# Altium schematic sheet Main.SchDoc
size A3
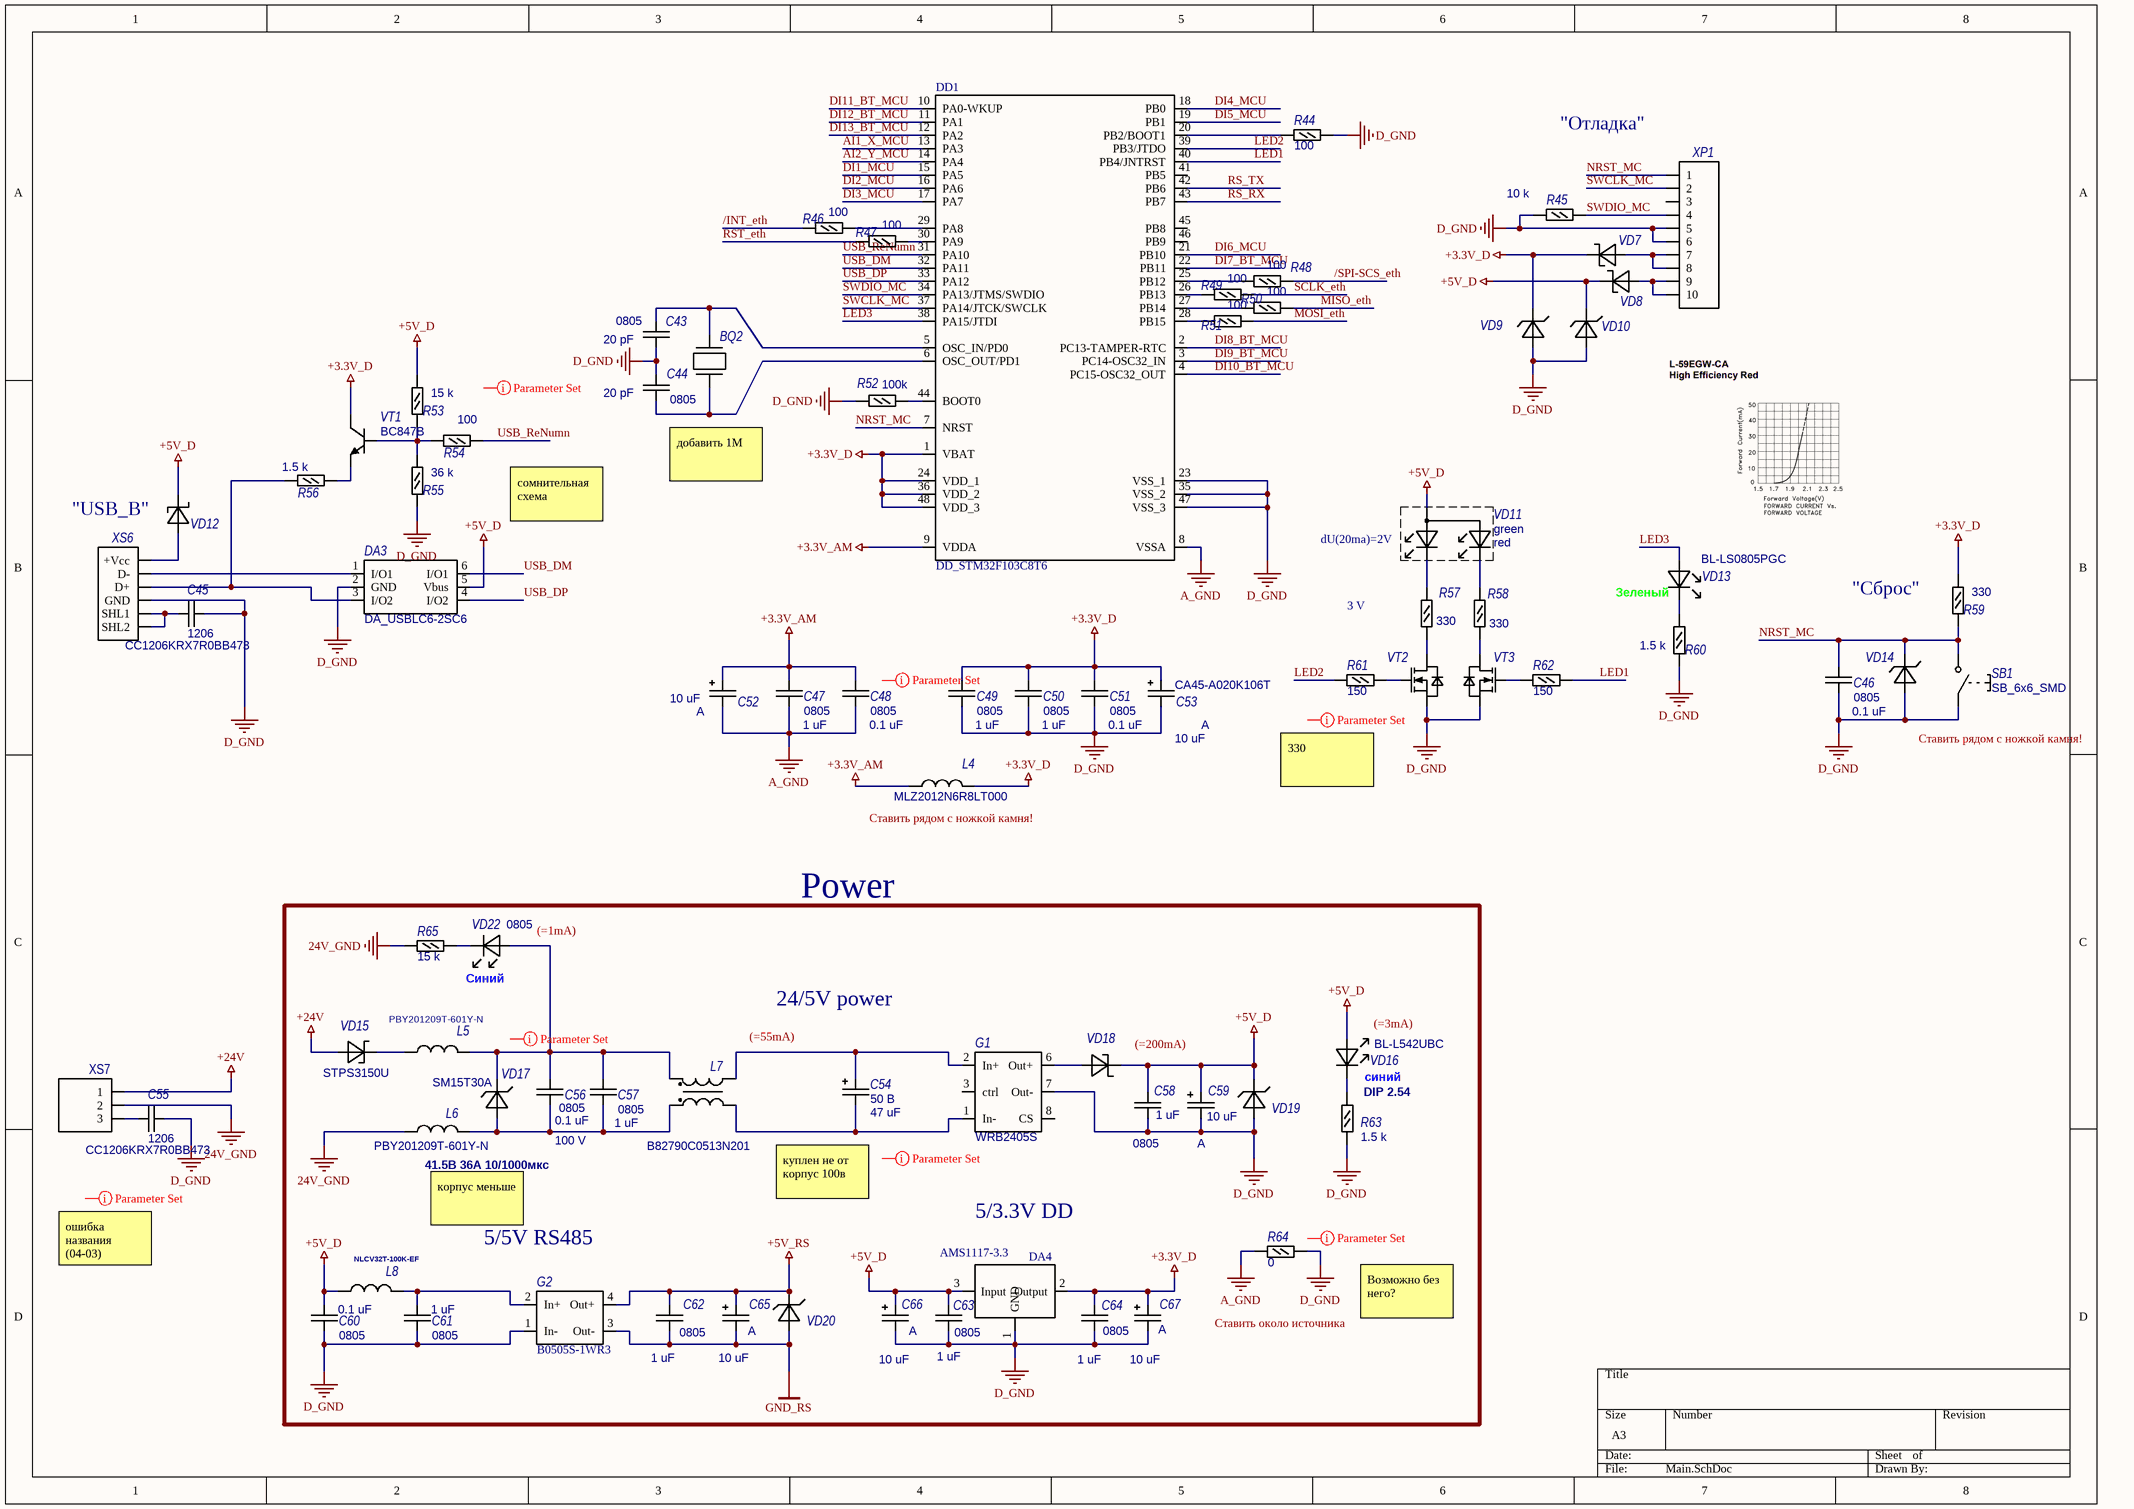
[diagram p0: Main.SchDoc]

## Parts
BQ2  (no value)  [Xtal_HC49S]
C43  0805  Номинал: 20 pF  [CAP_0805_(2x1.25x1.3)]
C44  0805  Номинал: 20 pF  [CAP_0805_(2x1.25x1.3)]
C45  1206  Наименование: CC1206KRX7R0BB473  [CAP_1206_(3.2x1.6x1.5)]
C46  0805  Номинал: 0.1 uF  [CAP_0805_(2x1.25x1.3)]
C47  0805  Номинал: 1 uF  [CAP_0805_(2x1.25x1.3)]
C48  0805  Номинал: 0.1 uF  [CAP_0805_(2x1.25x1.3)]
C49  0805  Номинал: 1 uF  [CAP_0805_(2x1.25x1.3)]
C50  0805  Номинал: 1 uF  [CAP_0805_(2x1.25x1.3)]
C51  0805  Номинал: 0.1 uF  [CAP_0805_(2x1.25x1.3)]
C52  Корпус: A  Номинал: 10 uF  [CAP_TAN_A]  (hidden comment: TAN_A)
C53  Корпус: A  Наименование: CA45-A020K106T  Номинал: 10 uF  [CAP_TAN_A]  (hidden comment: TAN_A)
C54  Напряжение: 50 В  Номинал: 47 uF  [CAP_EL_K50-35_(8x11.5)]  (hidden comment: K50-35)
C55  1206  Наименование: CC1206KRX7R0BB473  [CAP_1206_(3.2x1.6x1.5)]
C56  0805  Напряжение: 100 V  Номинал: 0.1 uF  [CAP_0805_(2x1.25x1.3)]
C57  0805  Номинал: 1 uF  [CAP_0805_(2x1.25x1.3)]
C58  0805  Номинал: 1 uF  [CAP_0805_(2x1.25x1.3)]
C59  Корпус: A  Номинал: 10 uF  [CAP_TAN_A]  (hidden comment: TAN_A)
C60  0805  Номинал: 0.1 uF  [CAP_0805_(2x1.25x1.3)]
C61  0805  Номинал: 1 uF  [CAP_0805_(2x1.25x1.3)]
C62  0805  Номинал: 1 uF  [CAP_0805_(2x1.25x1.3)]
C63  0805  Номинал: 1 uF  [CAP_0805_(2x1.25x1.3)]
C64  0805  Номинал: 1 uF  [CAP_0805_(2x1.25x1.3)]
C65  Корпус: A  Номинал: 10 uF  [CAP_TAN_A]  (hidden comment: TAN_A)
C66  Корпус: A  Номинал: 10 uF  [CAP_TAN_A]  (hidden comment: TAN_A)
C67  Корпус: A  Номинал: 10 uF  [CAP_TAN_A]  (hidden comment: TAN_A)
DA3  DA_USBLC6-2SC6  [SOT-23-6L]
DA4  AMS1117-3.3  [SOT-223_Dupl]
DD1  DD_STM32F103C8T6  [LQFP_48]
G1  WRB2405S  [WRB2405S(SIP-8) - duplicate]
G2  Наименование: B0505S-1WR3  [AM1S-Z]  (hidden comment: AM1S-Z)
L4  Наименование: MLZ2012N6R8LT000  [L_0805]  (hidden comment: PBY201209T-601Y-N)
L5  PBY201209T-601Y-N  [L_0805]
L6  PBY201209T-601Y-N  [L_0805]
L7  Наименование: B82790C0513N201  [B82790]  (hidden comment: B82790)
L8  Наименование: NLCV32T-100K-EF  [L_SRN3015]  (hidden comment: SRN3015)
R44  Номинал: 100  [RES_0805_(2x1.2x0.45)_0.125Вт]  (hidden comment: 0805)
R45  Номинал: 10 k  [RES_0805_(2x1.2x0.45)_0.125Вт]  (hidden comment: 0805)
R46  Номинал: 100  [RES_0805_(2x1.2x0.45)_0.125Вт]  (hidden comment: 0805)
R47  Номинал: 100  [RES_0805_(2x1.2x0.45)_0.125Вт]  (hidden comment: 0805)
R48  Номинал: 100  [RES_0805_(2x1.2x0.45)_0.125Вт]  (hidden comment: 0805)
R49  Номинал: 100  [RES_0805_(2x1.2x0.45)_0.125Вт]  (hidden comment: 0805)
R50  Номинал: 100  [RES_0805_(2x1.2x0.45)_0.125Вт]  (hidden comment: 0805)
R51  Номинал: 100  [RES_0805_(2x1.2x0.45)_0.125Вт]  (hidden comment: 0805)
R52  Номинал: 100k  [RES_0805_(2x1.2x0.45)_0.125Вт]  (hidden comment: 0805)
R53  Номинал: 15 k  [RES_0805_(2x1.2x0.45)_0.125Вт]  (hidden comment: 0805)
R54  Номинал: 100  [RES_0805_(2x1.2x0.45)_0.125Вт]  (hidden comment: 0805)
R55  Номинал: 36 k  [RES_0805_(2x1.2x0.45)_0.125Вт]  (hidden comment: 0805)
R56  Номинал: 1.5 k  [RES_0805_(2x1.2x0.45)_0.125Вт]  (hidden comment: 0805)
R57  Номинал: 330  [RES_0805_(2x1.2x0.45)_0.125Вт]  (hidden comment: 0805)
R58  Номинал: 330  [RES_0805_(2x1.2x0.45)_0.125Вт]  (hidden comment: 0805)
R59  Номинал: 330  [RES_0805_(2x1.2x0.45)_0.125Вт]  (hidden comment: 0805)
R60  Номинал: 1.5 k  [RES_0805_(2x1.2x0.45)_0.125Вт]  (hidden comment: 0805)
R61  Номинал: 150  [RES_0805_(2x1.2x0.45)_0.125Вт]  (hidden comment: 0805)
R62  Номинал: 150  [RES_0805_(2x1.2x0.45)_0.125Вт]  (hidden comment: 0805)
R63  Номинал: 1.5 k  [RES_0805_(2x1.2x0.45)_0.125Вт]  (hidden comment: 0805)
R64  Номинал: 0  [RES_0805_(2x1.2x0.45)_0.125Вт]  (hidden comment: 0805)
R65  Номинал: 15 k  [RES_0805_(2x1.2x0.45)_0.125Вт]  (hidden comment: 0805)
SB1  SB_6x6_SMD  [SB_6x6_SMD]
VD7  VD_SH_SMA  [VD_SMA_(Do-214AC)]  (value not drawn)
VD8  VD_SH_SMA  [VD_SMA_(Do-214AC)]  (value not drawn)
VD9  ESD  [VD_SOD523]  (value not drawn)
VD10  ESD  [VD_SOD523]  (value not drawn)
VD11  Тип: green  Примечания: red  [VD_LEDsx2]  (hidden comment: VD_Ledx2_dip)
VD12  VD_SH_SMA  [VD_SMA_(Do-214AC)]  (value not drawn)
VD13  Наименование: BL-LS0805PGC  Примечания: Зеленый  [led_0805]  (hidden comment: VD_Led_0805)
VD14  ESD  [VD_SOD523]  (value not drawn)
VD15  STPS3150U  [VD_SMB_(Do-214AA)]
VD16  Корпус: DIP 2.54  Наименование: BL-L542UBC  Примечания: синий  [VD_LED_dip]  (hidden comment: VD_Led)
VD17  SM15T30A  Номинал: 41.5В 36А 10/1000мкс  [VD_SMC_(Do-214AB)]
VD18  VD_SH_SMA  [VD_SMA_(Do-214AC)]  (value not drawn)
VD19  VD_SMA  [VD_SMA_(Do-214AC)]  (value not drawn)
VD20  VD_SMA  [VD_SMA_(Do-214AC)]  (value not drawn)
VD22  Корпус: 0805  Примечания: Синий  [led_0805]  (hidden comment: VD_Led_0805)
VT1  BC847B  [SOT-23]
VT2  VT_IRLML0040TRPBF  [SOT-23]  (value not drawn)
VT3  VT_IRLML0040TRPBF  [SOT-23]  (value not drawn)
XP1  XP_5x2_V  [XP_5x2_PIN_V]  (value not drawn)
XS6  XS_USB_B  [XS_USBB]  (value not drawn)
XS7  XS_3_pin_3.8mm  [XS_3_Pin _3.8mm]  (value not drawn)

## Blocks framed on the sheet
Power: C54 C56-C67 DA4 G1 G2 L5-L8 R63-R65 VD15-VD20 VD22

## Nets
24V_GND: L6.1 R65.1 XS7.2
+3.3V_AM: C47.2 C48.2 C52.1 DD1.9(VDDA) L4.1
+3.3V_D: C49.2 C50.2 C51.2 C53.1 C64.2 C67.1 DA4.2(Output) DD1.1(VBAT) DD1.24(VDD_1) DD1.36(VDD_2) DD1.48(VDD_3) L4.2 R59.1 VD7.2(K) VD9.2(K) VT1.3(C)
+5V_D: C58.2 C59.1 C60.2 C63.2 C66.1 DA3.5(Vbus) DA4.3(Input) L8.1 R53.2 VD8.2(K) VD10.2(K) VD11.2(A) VD12.2(K) VD16.1(A) VD18.2(K) VD19.2(K)
+5V_RS: C62.2 C65.1 G2.4(Out+) VD20.2(K)
+24V: VD15.1(A) XS7.1
A_GND: C47.1 C48.1 C52.2 DD1.8(VSSA) R64.1
D_GND: C43.1 C44.2 C45.2 C46.1 C49.1 C50.1 C51.1 C53.2 C55.2 C58.1 C59.2 C60.1 C61.1 C63.1 C64.1 C66.2 C67.2 DA3.2(GND) DA4.1(GND) DD1.23(VSS_1) DD1.35(VSS_2) DD1.47(VSS_3) G1.7(Out-) G2.1(In-) R44.1 R45.2 R52.2 R55.1 R60.1 R63.1 R64.2 SB1.1 VD9.1(A) VD10.1(A) VD14.1(A) VD19.1(A) VT2.2(S) VT3.2(S) XP1.5 XP1.6 XS6.4(GND)
GND_RS: C62.1 C65.2 G2.3(Out-) VD20.1(A)
/INT_eth: R46.2
/SPI-SCS_eth: R48.1
AI1_X_MCU: DD1.13(PA3)
AI2_Y_MCU: DD1.14(PA4)
DI1_MCU: DD1.15(PA5)
DI2_MCU: DD1.16(PA6)
DI3_MCU: DD1.17(PA7)
DI4_MCU: DD1.18(PB0)
DI5_MCU: DD1.19(PB1)
DI6_MCU: DD1.21(PB10)
DI7_BT_MCU: DD1.22(PB11)
DI8_BT_MCU: DD1.2(PC13-TAMPER-RTC)
DI9_BT_MCU: DD1.3(PC14-OSC32_IN)
DI10_BT_MCU: DD1.4(PC15-OSC32_OUT)
DI11_BT_MCU: DD1.10(PA0-WKUP)
DI12_BT_MCU: DD1.11(PA1)
DI13_BT_MCU: DD1.12(PA2)
LED1: DD1.40(PB4/JNTRST) R62.2
LED2: DD1.39(PB3/JTDO) R61.1
LED3: DD1.38(PA15/JTDI) VD13.1(A)
MISO_eth: R50.1
MOSI_eth: R51.1
NRST_MC: C46.2 DD1.7(NRST) R59.2 SB1.2 VD14.2(K) XP1.1
RS_RX: DD1.43(PB7)
RS_TX: DD1.42(PB6)
RST_eth: R47.2
SCLK_eth: R49.1
SWCLK_MC: DD1.37(PA14/JTCK/SWCLK) XP1.2
SWDIO_MC: DD1.34(PA13/JTMS/SWDIO) R45.1 XP1.4
USB_DM: DA3.6(I/O1) DD1.32(PA11)
USB_DP: DA3.4(I/O2) DD1.33(PA12)
USB_ReNumn: DD1.31(PA10) R54.1
NetBQ2_1: BQ2.1 C44.1 DD1.6(OSC_OUT/PD1)
NetBQ2_2: BQ2.2 C43.2 DD1.5(OSC_IN/PD0)
NetC45_1: C45.1 XS6.5(SHL1) XS6.6(SHL2)
NetC54_1: C54.1 G1.2(In+) L7.4
NetC54_2: C54.2 G1.1(In-) L7.3
NetC55_1: C55.1 XS7.3
NetC56_1: C56.1 C57.1 L6.2 L7.2 VD17.1(A)
NetC56_2: C56.2 C57.2 L5.2 L7.1 VD17.2(K) VD22.1(A)
NetC61_2: C61.2 G2.2(In+) L8.2
NetDA3_1: DA3.1(I/O1) XS6.2(D-)
NetDA3_3: DA3.3(I/O2) R56.2 XS6.3(D+)
NetDD1_20: DD1.20(PB2/BOOT1) R44.2
NetDD1_25: DD1.25(PB12) R48.2
NetDD1_26: DD1.26(PB13) R49.2
NetDD1_27: DD1.27(PB14) R50.2
NetDD1_28: DD1.28(PB15) R51.2
NetDD1_29: DD1.29(PA8) R46.1
NetDD1_30: DD1.30(PA9) R47.1
NetDD1_44: DD1.44(BOOT0) R52.1
NetG1_6: G1.6(Out+) VD18.1(A)
NetL5_1: L5.1 VD15.2(K)
NetR53_1: R53.1 R54.2 R55.2 VT1.1(B)
NetR56_1: R56.1 VT1.2(E)
NetR57_1: R57.1 VD11.3(K2)
NetR57_2: R57.2 VT2.3(D)
NetR58_1: R58.1 VD11.1(K1)
NetR58_2: R58.2 VT3.3(D)
NetR60_2: R60.2 VD13.2(K)
NetR61_2: R61.2 VT2.1(G)
NetR62_1: R62.1 VT3.1(G)
NetR63_2: R63.2 VD16.2(K)
NetR65_2: R65.2 VD22.2(K)
NetVD7_1: VD7.1(A) XP1.7 XP1.8
NetVD8_1: VD8.1(A) XP1.9 XP1.10
NetVD12_1: VD12.1(A) XS6.1(+Vcc)

Not connected (* = marked no-connect by the designer): DD1 41(PB5) 45(PB8) 46(PB9); G1 3(ctrl) 8(CS); XP1 3

## Notes on the sheet
- "Отладка"
- "USB_B"
- сомнительная схема
- добавить 1М
- (near VD11) dU(20ma)=2V
- 3 V
- (near R59) "Сброс"
- 330
- Ставить рядом с ножкой камня!
- (near L4) Ставить рядом с ножкой камня!
- (near VD22) (=1mA)
- (near L7) (=55mA)
- 24/5V power
- (near VD18) (=200mA)
- (near VD16) (=3mA)
- куплен не от корпус 100в
- ошибка названия (04-03)
- (near L6) корпус меньше
- (near G2) 5/5V RS485
- 5/3.3V DD
- Ставить около источника
- Возможно без него?

## Library data of the parts
BQ2 = Xtal: Корпус: HC-49S; Наименование: 8.000 МГц HC-49S; Номинал: 8Mhz; Поставщик: chipdip; Идентификатор: 8.000 МГц HC-49S
C43 C44 = C_0805: Керамика; Тип: Конденсатор; Наименование: TCC0805COG200J500BT; Аналог: GRM2165C1H200J; Корпус: 0805; Идентификатор: TCC0805COG200J500BT
C45 C55 = C_1206: Керамика; Тип: Конденсатор; Напряжение: 250 В; Номинал: 0.047 uF; Аналог: GRM31CR72E473K; Корпус: 1206; Идентификатор: CC1206KRX7R0BB473
C46 C48 C51 C60 = C_0805: Керамика; Тип: Конденсатор; Наименование: CC0805KRX7R9BB104; Аналог: GRM21BR71H104K; Корпус: 0805; Идентификатор: CC0805KRX7R9BB104
C47 C49 C50 C57 C58 C61-C64 = C_0805: Керамика; Тип: Конденсатор; Наименование: TCC0805X7R105K500FT; Аналог: GRM21BR71H105K; Корпус: 0805; Идентификатор: TCC0805X7R105K500FT
C52 C59 C65-C67 = C+_TAN_A: Capacitor; Тип: Конденсатор; Наименование: CA45-A020K106T
C53 = C+_TAN_A: Capacitor; Тип: Конденсатор
C54 = C+_K50-35_(8x11.5): Capacitor; Тип: Конденсатор; Корпус: 8x11.5; Наименование: ECAP (К50-35 мини); Поставщик: chipdip
C56 = C_0805: Керамика; Тип: Конденсатор; Наименование: TCC0805X7R104K101FT; Корпус: 0805; Идентификатор: TCC0805X7R104K101FT; Аналог: TCC0805X7R104K101FT
DA3 = DA_USBLC6-2SC6: USB ESD protector SOT23-6; Тип: ESD protector; Корпус: SOT23-6; Наименование: USBLC6-2SC6
DA4 = DA_AMS1117-3.3: 0.8A Low Dropout Voltage Regulator       SOT 223; Наименование: AMS1117-3.3
DD1 = DD_STM32F103C8T6: STM32 ARM-based 32-bit MCU with 128 Kbytes Flash, 48-pin LQFP, Industrial Temperature; Наименование: STM32F103CBT6; Аналог: APM32F103CBT6; Published: 30-May-2008; DatasheetVersion: rev6, Mar-2008; PackageVersion: Mar-2008; PackageReference: LQFP48; Publisher: Altium Limited; PackageDescription: 48-Pin Low-Profile Quad Flat Pack, 7 x 7 mm Body, 0.5 mm Pitch (LQFP48); ComponentLink1Description: Manufacturer Link; ComponentLink1URL: www.st.com/stm32; ComponentLink2Description: Datasheet; ComponentLink2URL: http://www.st.com/stonline/products/literature/ds/13587.pdf
G1 = G_WRB2405S-1WR2: DC/DC; Номинал: 1 Вт 24/5 В; Наименование: WRB2405S-1WR2
G2 = G_AM1S-Z: DC/DC
L4-L6 = L_PBY201209T-601Y-N: L; Тип: Индуктивность
  L5 L6: Наименование: PBY201209T-601Y-N
L7 = L_B82790: L; Тип: Индуктивность
L8 = L_SRN3015: L; Тип: Индуктивность
R44 R46-R51 R54 = R_0805: Resistor; Тип: Резистор; Наименование: RC0805JR-07100RL; Корпус: 0805; Идентификатор: RC0805JR-07100RL
R45 = R_0805: Resistor; Тип: Резистор; Наименование: RC0805JR-0710KL; Корпус: 0805; Идентификатор: RC0805JR-0710KL
R52 = R_0805: Resistor; Тип: Резистор; Наименование: RC0805JR-07100KL; Корпус: 0805; Идентификатор: RC0805JR-07100KL
R53 R65 = R_0805: Resistor; Тип: Резистор; Наименование: RC0805JR-0715KL; Корпус: 0805; Идентификатор: RC0805JR-0715KL
R55 = R_0805: Resistor; Тип: Резистор; Наименование: RC0805JR-0736KL; Корпус: 0805; Идентификатор: RC0805JR-0736KL
R56 R60 R63 = R_0805: Resistor; Тип: Резистор; Наименование: RC0805JR-071K5L; Корпус: 0805; Идентификатор: RC0805JR-071K5L
R57-R59 = R_0805: Resistor; Тип: Резистор; Наименование: RC0805JR-07330RL; Корпус: 0805; Идентификатор: RC0805JR-07330RL
R61 R62 = R_0805: Resistor; Тип: Резистор; Наименование: RC0805JR-07150RL; Корпус: 0805; Идентификатор: RC0805JR-07150RL
R64 = R_0805: Resistor; Тип: Резистор; Наименование: RC0805JR-070RL; Корпус: 0805; Идентификатор: RC0805JR-070RL
SB1 = SB_6x6_SMD: Корпус: 6x6; Наименование: KLS7-TS6604-4.3-180
VD7 VD8 VD12 VD18 = VD_SH_SMA: Sh_Diode; Тип: Диод Шоттки; Корпус: SMA; Наименование: 10MQ030NPBF; Напряжение: 30В; Номинал: 1А; Поставщик: chipdip
VD9 VD14 = VD_ESD: Защитный диод; Корпус: SOD523; Наименование: ESD5Z3.3T1G TVS; Напряжение: 3.3В; Тип: Диод
VD10 = VD_ESD: Защитный диод; Корпус: SOD523; Наименование: ESD5B5.0ST1G; Напряжение: 5В; Тип: Диод
VD11 = VD_Ledx2_dip: Наименование: L-59EGW-CA
VD13 = VD_Led_0805: Корпус: 0805
VD15 = VD_STPS3150U: Диод Шоттки 150В 3А [SMB]; Корпус: SMB; Тип: Диод; Наименование: STPS3150U; Напряжение: 150В; Номинал: 3А
VD16 = VD_Led: Идентификатор: BL-L2506UBC
VD17 = VD_SMCJ48A: Защитный диод 48В; Корпус: SMC; Напряжение: 30В; Тип: Диод; Наименование: SM15T30A
VD19 VD20 = VD_SMA: Diode; Тип: Диод; Корпус: SMA; Наименование: SMAJ5.0A; Напряжение: 5В
VD22 = VD_Led_0805: Наименование: BL-LS0805DNB; Идентификатор: BL-LS0805DNB
VT1 = VT_BC847B: NPN Bipolar Transistor; Напряжение: 45В; Номинал: 0.1А; Тип: NPN; Корпус: SOT-23; Наименование: BC847B
VT2 VT3 = VT_IRLML0040TRPBF: N Mosfet 3.6A; Наименование: BSS123; Корпус: SOT-23
XP1 = XP_5x2_V: Наименование: BH10; Аналог: DS1013-10SSiB1-B-0; Идентификатор: BH10
XS6 = XS_USB_B: Корпус: USB-B; Наименование: DS1099-WN0-FE
XS7 = XS_3_pin_3.8mm: Наименование: 15EDGRC-3.81-04; Примечания: 15EDGK-3.81-04